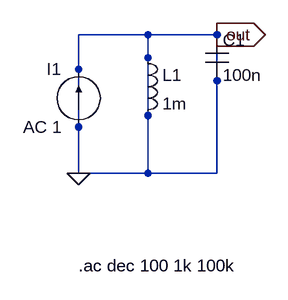
[diagram p0: schematic test_parallel_lc.asc]
test_parallel_lc.asc, the LTspice schematic file:
Version 4
SHEET 1 1600 680
WIRE 0 192 0 384
WIRE 0 192 96 192
WIRE 96 192 96 304
WIRE 96 304 96 384
WIRE 96 192 192 192
WIRE 192 192 192 256
WIRE 192 256 192 384
WIRE 192 384 96 384
WIRE 96 384 0 384
FLAG 0 384 0
FLAG 192 192 out
IOPIN 192 192 Out
SYMBOL current 0 320 R180
WINDOW 0 24 80 Left 2
WINDOW 3 24 0 Left 2
SYMATTR InstName I1
SYMATTR Value AC 1
SYMBOL ind 80 208 R0
SYMATTR InstName L1
SYMATTR Value 1m
SYMBOL cap 176 192 R0
SYMATTR InstName C1
SYMATTR Value 100n
TEXT 0 512 Left 2 !.ac dec 100 1k 100k

The netlist it stands for:
* test_parallel_lc.asc
I1 0 0 AC 1
L1 0 0 1m
C1 0 0 100n
.ac dec 100 1k 100k
.backanno
.end